# Altium schematic sheet EMI_FILTER.SchDoc
size A4; SheetNumber: 9; SheetTotal: 9
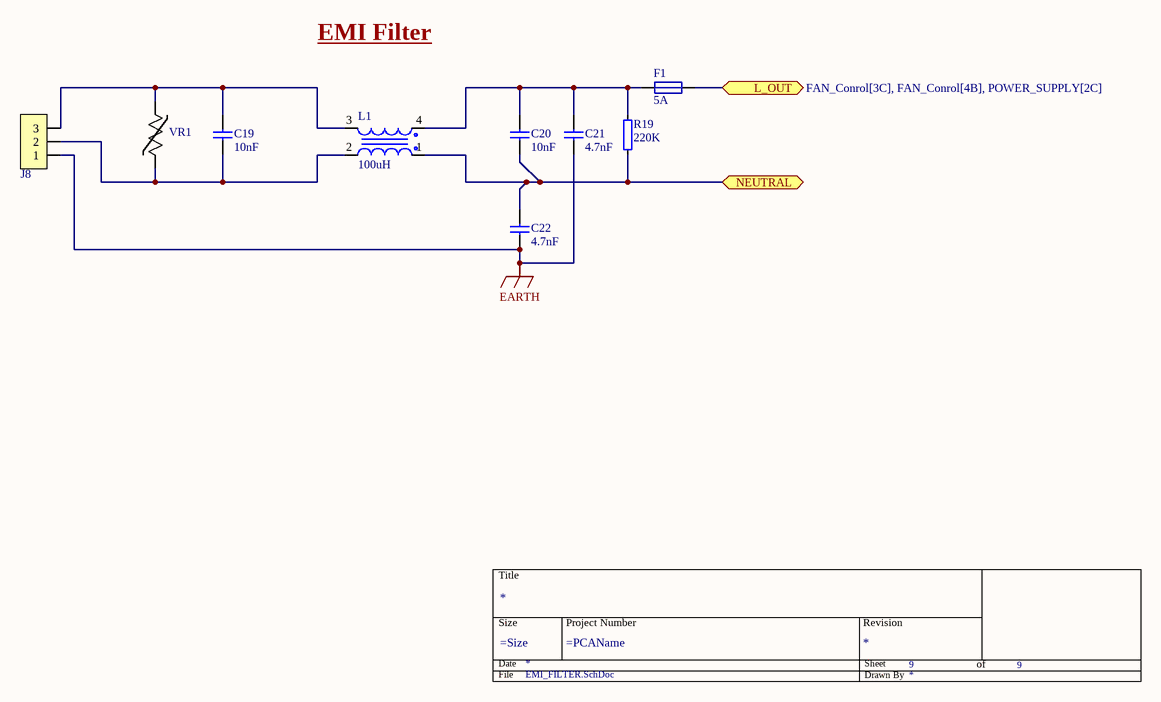
[diagram p0: EMI_FILTER.SchDoc]

## Parts
*  Title Block  (value not drawn)  (graphical)
C19  10nF  [CAPRR1500W60L1850T800H1650]
C20  10nF  [CAPRR1500W60L1850T800H1650]
C21  4.7nF  [CAPRR1500W60L1850T800H1650]
C22  4.7nF  [CAPRR1500W60L1850T800H1650]
F1  5A  [Fuse 5X20mm]
J8  1935174  [PHOENIX_1935174]  (value not drawn)
L1  100uH  [UU10.5-10mH]
R19  220K  [RES_ROX2S_TYCO_TYC]
VR1  S14K561  [VRES_B72214_2301_EPC]  (value not drawn)

## Ports
L_OUT (bidir, see FAN_Conrol[3C], FAN_Conrol[4B], POWER_SUPPLY[2C]), NEUTRAL (bidir, see FAN_Conrol[1C], FAN_Conrol[3C], POWER_SUPPLY[2C])

## Nets
EARTH: C21.1 C22.1 J8.1
L_OUT: F1.2 ; port L_OUT
NEUTRAL: C20.1 C22.2 L1.1 R19.1 ; port NEUTRAL
NetC19_1: C19.1 J8.2 L1.2 VR1.2
NetC19_2: C19.2 J8.3 L1.3 VR1.1
NetC20_2: C20.2 C21.2 F1.1 L1.4 R19.2

## Notes on the sheet
- EMI Filter
- (in symbol Title Block) Title; Size; Project Number; Revision; Date; Sheet; of; File; Drawn By

## Library data of the parts
C19 C20 = 0.1uF 300V: Capacitor, Metalized Polypropylene Film,300VAC, 10nF, +-10%; Part Number: 10nF 300V; Manufacturer Part Number: 10nF 300V; Pin Count: 2; Publisher: Metal Circuits; Value: 10nF
C21 C22 = 0.1uF 300V: Capacitor, Metalized Polypropylene Film,300VAC, 4.7nF, +-10%; Part Number: 4.7nF 300V; Manufacturer Part Number: 4.7nF 300V; Pin Count: 2; Publisher: Metal Circuits; Value: 4.7nF
F1 = Fuse: 5x20 Fuse Holders ROHS; Part Number: Fuse Holder; Manufacturer Part Number: Fuse Holder; Pin Count: 2; Publisher: Metal Circuits; Value: 5A
J8 = 1935174: 3 Position Wire to Board Terminal Block Horizontal with Board 0.197" (5.00mm) Through Hole; Manufacturer: Phoenix Contact; Part Number: 1935174; Manufacturer Part Number: 1935174; Pin Count: 3; Publisher: Metal Circuits; Value: 1935174
L1 = UU10.5-10mH: 100uH@1kHz 1.5Ω 2 Plugin Common Mode Filters ROHS; Part Number: UU10.5-100uH; Manufacturer: FH (Guangdong Fenghua Advanced Tech); Manufacturer Part Number: UU10.5-100uH; Pin Count: 4; Publisher: Metal Circuits; Value: 100uH; Supplier 1: LCSC; Supplier Part Number 1: C191661
R19 = RES 1Watt: Carbon Film Through Hole Resistor 1Watt 1%; Part Number: RES 1 Watt; Pin Count: 2; Publisher: Metal Circuits; Value: 220K
VR1 = S14K230: Tv - Varistors, Mov Circuit Protection 4.5kA 470V; Part Number: S14K561; Manufacturer Part Number: S14K561; Pin Count: 2; Publisher: Metal Circuits; Value: S14K561